# Altium project My Seeeduino Nano.PrjPcb
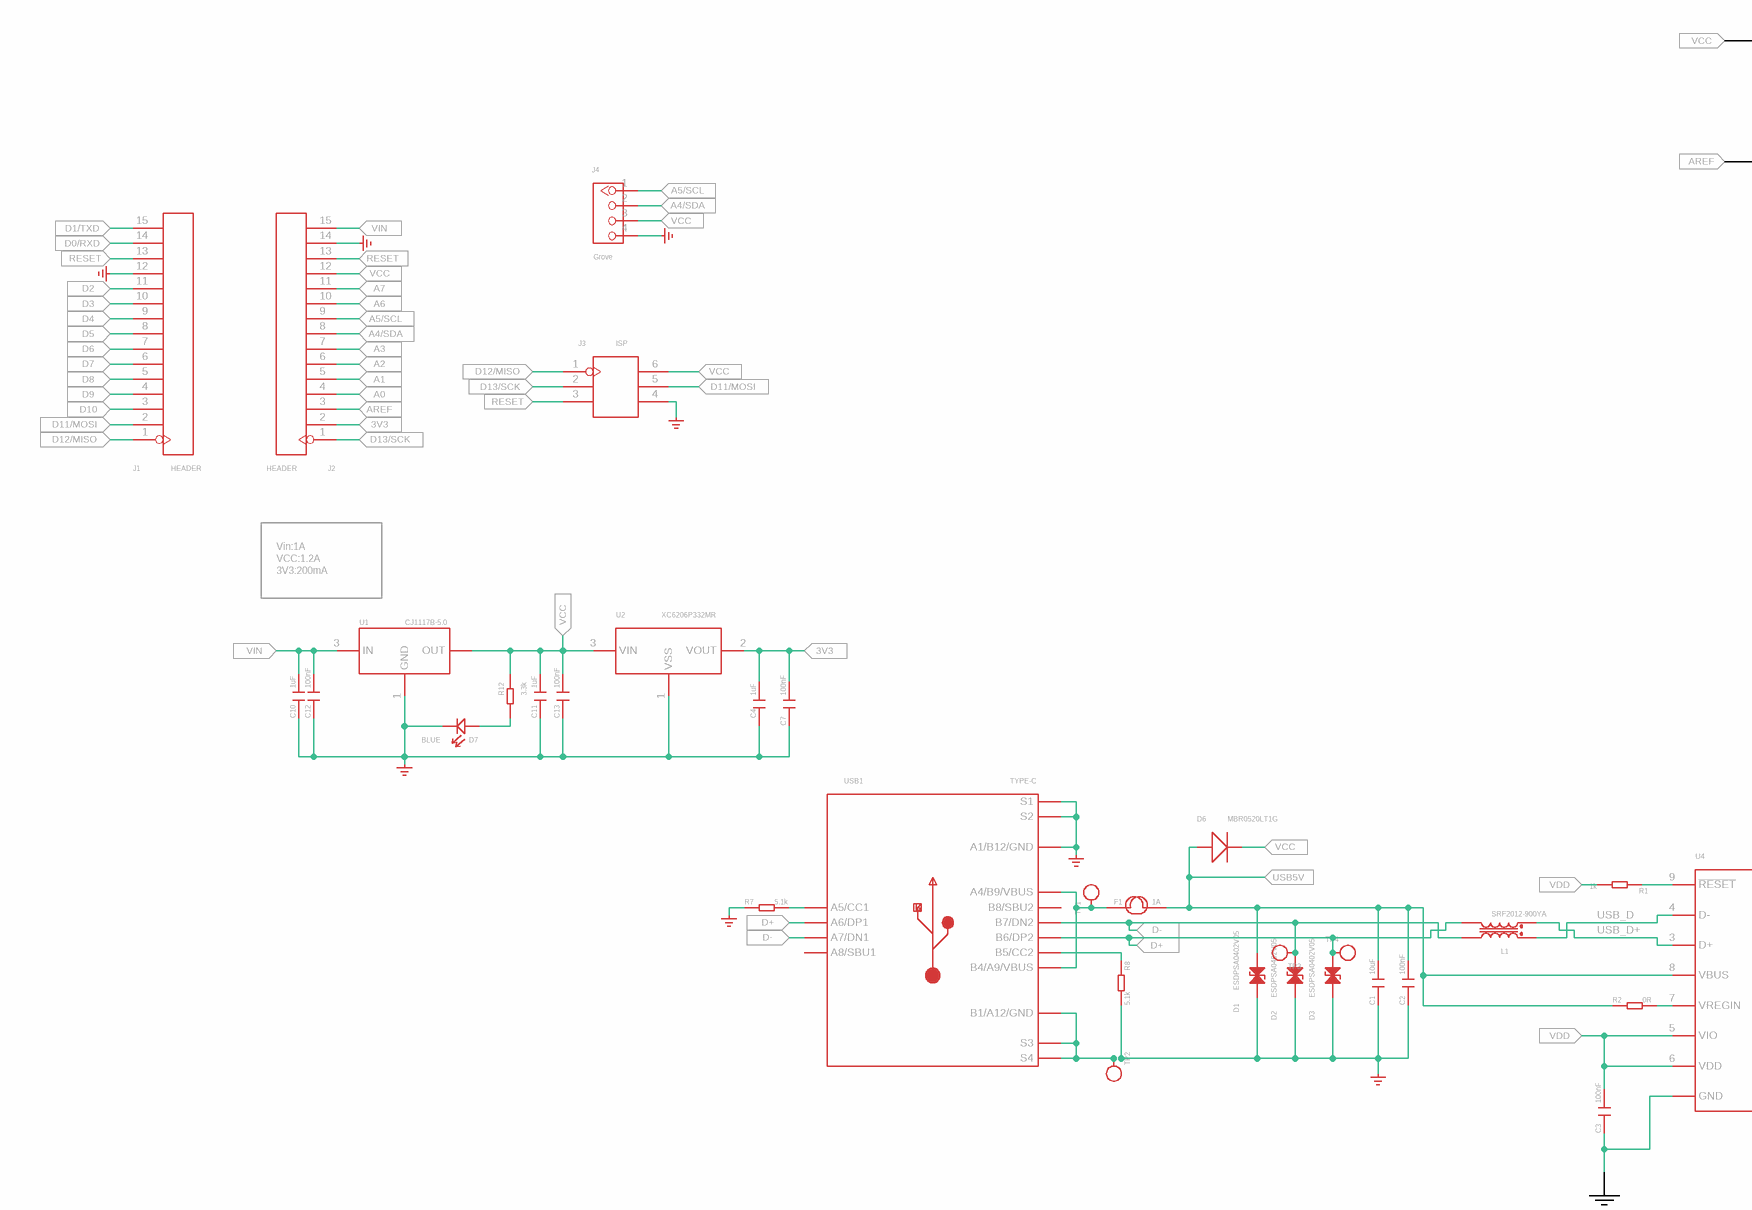
[diagram p0: Лист1.SchDoc, top left]
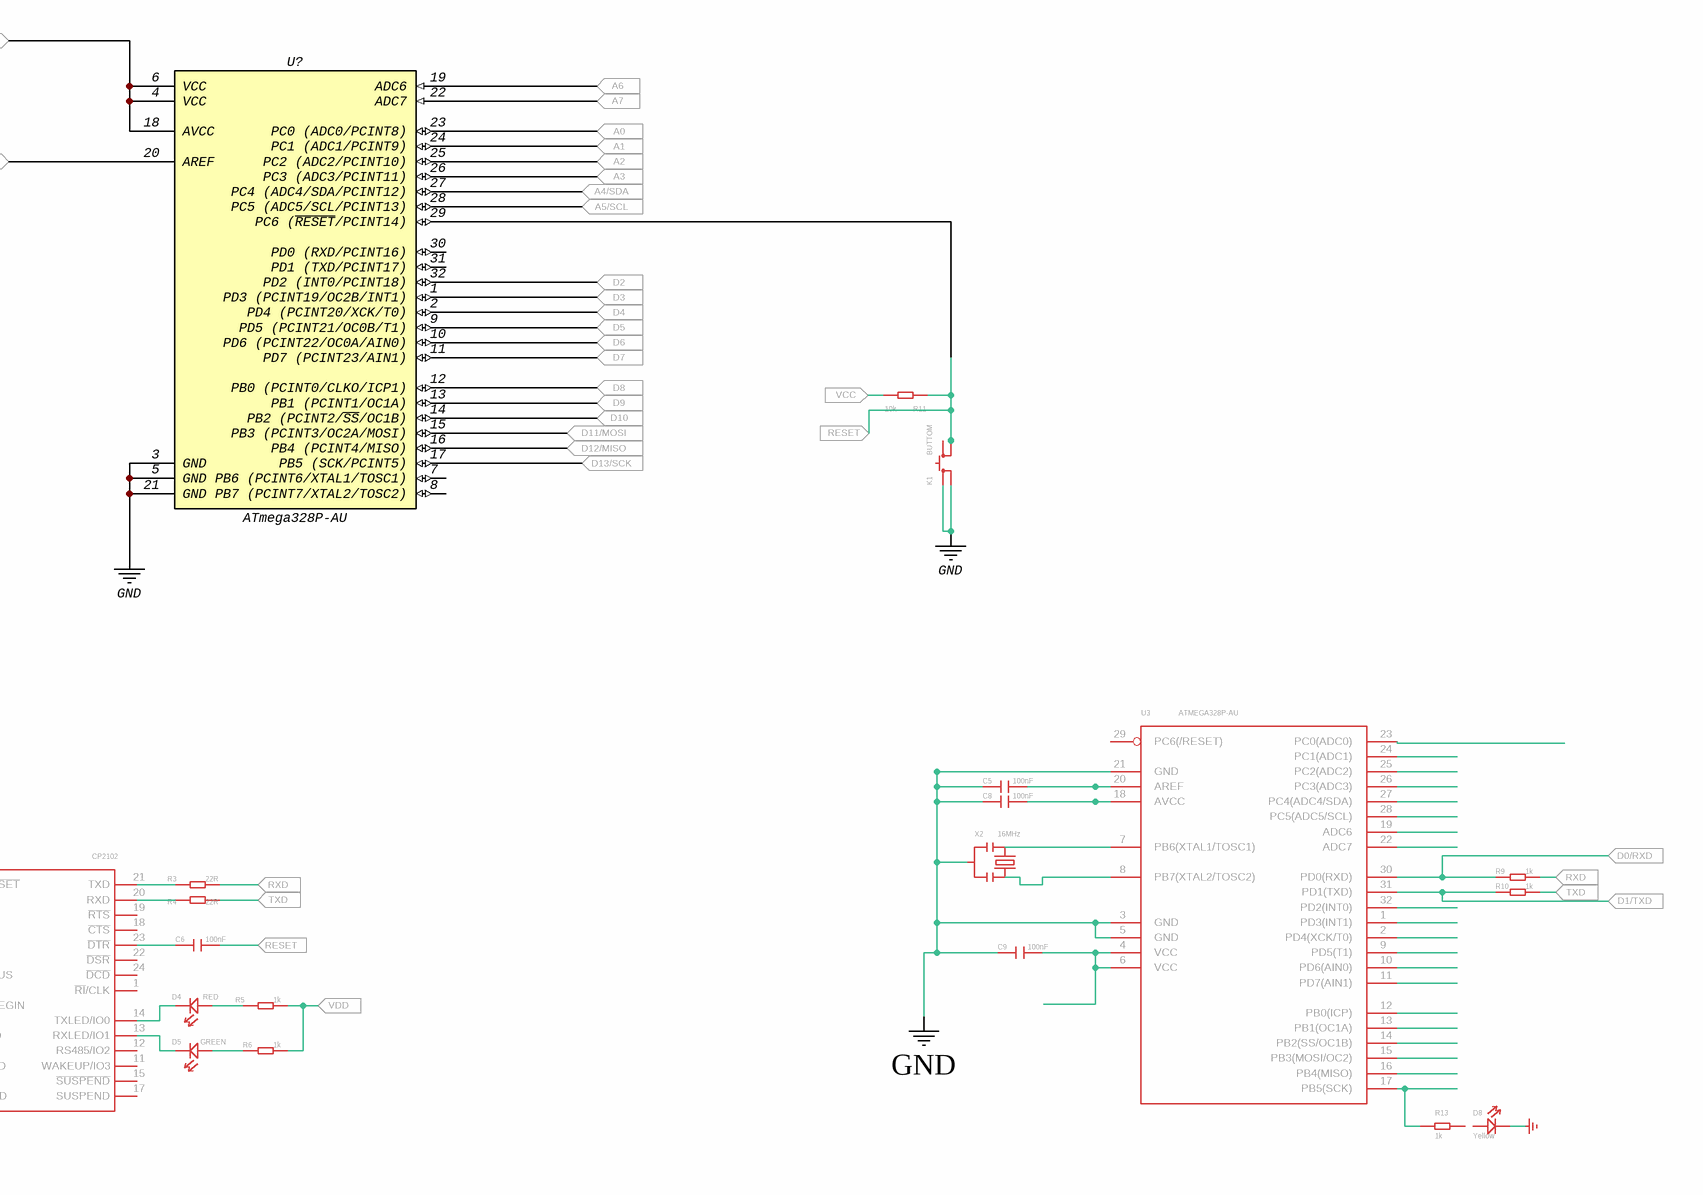
[diagram p1: Лист1.SchDoc, top right]
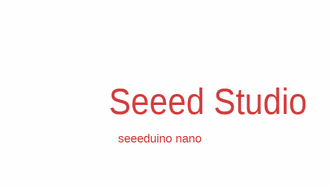
[diagram p2: Лист1.SchDoc, bottom right]
1 sheet, 61 parts. Net scope: flat (ports and power ports of the same name join across sheets).
Board file: Узел.PcbDoc

## Sheet Лист1.SchDoc
size 839 x 594 mm; Origin: Eagle; GateName_1: G$1; SymbolName_1: SEEEDSTUDIO-SCH-FRAME-BIG; LibraryName: moudle-new; DeviceSetName: SEEEDSTUDIO-SCH-FRAME-BIG; Sheet: Sheet:; SeeedStudio: Seeed Studio; Design: Design:; Check: Check:; Vision: Vision:; CC-BY-SA: CC-BY-SA; SheetNumber: 1; SheetTotal: 2; PageSetup: Record=PageOptions|CenterHorizontal=True|CenterVertical=True|PrintScale=0.94|XCorrection=1.00|YCorrection=1.00|PrintKind=1|BorderSize=5000000|LeftOffset=0|BottomOffset=0|Orientation=1|PaperLength=1000|PaperWidth=1000|Scale=100|PaperSource=7|PrintQuality=-4|MediaType=1|DitherType=10|PaperKind=A4|PrintScaleMode=1; ГОСТ 1: ГОСТ 2.104-2006 Глава 6, Форма 1; ГОСТ 2: ГОСТ 2.701-2008 Таблица 1, Таблица 2; ГОСТ 3: ГОСТ 2.301-68; ГОСТ 4: ГОСТ 2.302-68; DocumentName: Sheet1.SCHDOC

### Parts
C1  10uF  [C0603]
C2  100nF  [C0603]
C3  100nF  [C0603]
C4  1uF  [C0603]
C5  100nF  [C0603]
C6  100nF  [C0603]
C7  100nF  [C0603]
C8  100nF  [C0603]
C9  100nF  [C0603]
C10  1uF  [C0603]
C11  1uF  [C0603]
C12  100nF  [C0603]
C13  100nF  [C0603]
D1  ESDPSA0402V05  [ESD-0402]
D2  ESDPSA0402V05  [ESD-0402]
D3  ESDPSA0402V05  [ESD-0402]
D4  RED  [LED-0402]
D5  GREEN  [LED-0402]
D6  MBR0520LT1G  [SOD123-2.7X1.6]
D7  BLUE  [LED-0402]
D8  Yellow  [LED-0402]
F1  1A  [F1206]
G1  GND_POWER  (value not drawn)
G2  GND_POWER  (value not drawn)
G5  GND_POWER  (value not drawn)
G7  GND_POWER  (value not drawn)
G8  GND_POWER  (value not drawn)
G9  GND_POWER  (value not drawn)
G10  GND_POWER  (value not drawn)
G12  GND_POWER  (value not drawn)
G13  GND_POWER  (value not drawn)
J1  HEADER  [H15-2.54]
J2  HEADER  [H15-2.54]
J3  ISP  [H2X3-2.54]
J4  Grove  [HW4-2.0]
K1  BUTTOM  [SW4P-SMD-4.5X3.2X2.5MM]
L1  SRF2012-900YA  [INT4-0.85-2X1.25X1.2MM]
R1  1k  [R0603]
R2  0R  [R0603]
R3  22R  [R0603]
R4  22R  [R0603]
R5  1k  [R0603]
R6  1k  [R0603]
R7  5.1k  [R0603]
R8  5.1k  [R0603]
R9  1k  [R0603]
R10  1k  [R0603]
R11  10k  [R0603]
R12  3.3k  [R0603]
R13  1k  [R0603]
TP1  TEST  [TP-D45MIL]  (value not drawn)
TP2  TEST  [TP-D45MIL]  (value not drawn)
TP3  TEST  [TP-D45MIL]  (value not drawn)
TP4  TEST  [TP-D45MIL]  (value not drawn)
U1  CJ1117B-5.0  [SOT-223]
U2  XC6206P332MR  [SOT-23]
U3  ATMEGA328P-AU  [TQFP32-0.8-7X7MM]
U4  CP2102  [QFN24G-0.5-4X4MM]
U?  ATmega328P-AU  [32A_M]
USB1  TYPE-C  [USB2.0-TYPE-C]
X2  16MHz  [RESONATOR3-SMD-3.6X1.3X0.8MM]

### Ports
3V3 (in), A0 (in), A1 (in), A2 (in), A3 (in), A4/SDA (in), A5/SCL (in), A6 (in), A7 (in), AREF (in), D0/RXD (in), D1/TXD (in), D2 (in), D3 (in), D4 (in), D5 (in), D6 (in), D7 (in), D8 (in), D9 (in), D10 (in), D11/MOSI (in), D12/MISO (in), D13/SCK (in), D+ (in), D- (in), RESET (in), RXD (in), TXD (in), USB5V (in), VCC (in), VDD (in), VIN (in)

### Nets
GND: C3.2 C5.2 C8.2 C9.2 K1.1(A0) K1.2(A1) U3.3(GND) U3.5(GND) U3.21(GND) U4.2_PAD(GND) U?.3(GND) U?.5(GND) U?.21(GND) X2.2
USB_D: L1.1 U4.4(D-)
USB_D+: L1.4 U4.3(D+)
NetC1_1: C1.1 C2.1 D1.2 D6.1(+) F1.2 R2.1 U4.8(VBUS) ; port USB5V
NetC1_2: C1.2 C2.2 D1.1 D2.1 D3.1 G2.?1(GND) R8.2
NetC3_1: C3.1 R1.1 R5.2 R6.2 U4.5(VIO) U4.6(VDD) ; port VDD
NetC4_1: C4.1 C7.1 J2.2 U2.2(VOUT) ; port 3V3
NetC4_2: C4.2 C7.2 C10.2 C11.2 C12.2 C13.2 D7.- G7.?1(GND) U1.1(GND) U2.1(VSS)
NetC5_1: C5.1 U3.20(AREF)
NetC6_1: C6.1 J1.13 J2.13 J3.3 K1.4(B1) R11.1 U?.29(PC6_(~{RESET}/PCINT14)) ; port RESET
NetC6_2: C6.2 U4.23(~{DTR})
NetC8_1: C8.1 U3.18(AVCC)
NetC9_1: C9.1 U3.4(VCC) U3.6(VCC)
NetC10_1: C10.1 C12.1 J2.15 U1.3(IN) ; port VIN
NetC11_1: C11.1 C13.1 D6.2(-) J2.12 J3.6 J4.3 R11.2 R12.1 U1.2_TER(OUT) U2.3(VIN) U?.4(VCC) U?.6(VCC) U?.18(AVCC) ; port VCC
NetD2_2: D2.2 L1.2 TP3.T USB1.A7(A7/DN1) USB1.B7(B7/DN2) ; port D-
NetD3_2: D3.2 L1.3 TP4.T USB1.A6(A6/DP1) USB1.B6(B6/DP2) ; port D+
NetD4_+: D4.+ R5.1
NetD4_-: D4.- U4.14(TXLED/IO0)
NetD5_+: D5.+ R6.1
NetD5_-: D5.- U4.13(RXLED/IO1)
NetD7_+: D7.+ R12.2
NetD8_-: D8.- G8.?1(GND)
NetF1_1: F1.1 TP1.T USB1.A4_B9(A4/B9/VBUS) USB1.B4_A9(B4/A9/VBUS)
NetG1_?1: G1.?1(GND) USB1.A1_B12(A1/B12/GND) USB1.S1_S5(S1) USB1.S2_S6(S2)
NetG5_?1: G5.?1(GND) R7.1
NetG9_?1: G9.?1(GND) J2.14
NetG10_?1: G10.?1(GND) J1.12
NetG12_?1: G12.?1(GND) J3.4
NetG13_?1: G13.?1(GND) J4.4
NetJ1_1: J1.1 J3.1 U?.16(PB4_(PCINT4/MISO)) ; port D12/MISO
NetJ1_2: J1.2 J3.5 U?.15(PB3_(PCINT3/OC2A/MOSI)) ; port D11/MOSI
NetJ1_3: J1.3 U?.14(PB2_(PCINT2/~{SS}/OC1B)) ; port D10
NetJ1_4: J1.4 U?.13(PB1_(PCINT1/OC1A)) ; port D9
NetJ1_5: J1.5 U?.12(PB0_(PCINT0/CLKO/ICP1)) ; port D8
NetJ1_6: J1.6 U?.11(PD7_(PCINT23/AIN1)) ; port D7
NetJ1_7: J1.7 U?.10(PD6_(PCINT22/OC0A/AIN0)) ; port D6
NetJ1_8: J1.8 U?.9(PD5_(PCINT21/OC0B/T1)) ; port D5
NetJ1_9: J1.9 U?.2(PD4_(PCINT20/XCK/T0)) ; port D4
NetJ1_10: J1.10 U?.1(PD3_(PCINT19/OC2B/INT1)) ; port D3
NetJ1_11: J1.11 U?.32(PD2_(INT0/PCINT18)) ; port D2
NetJ1_14: J1.14 R9.1 U3.30(PD0(RXD)) ; port D0/RXD
NetJ1_15: J1.15 R10.1 U3.31(PD1(TXD)) ; port D1/TXD
NetJ2_1: J2.1 J3.2 U?.17(PB5_(SCK/PCINT5)) ; port D13/SCK
NetJ2_3: J2.3 U?.20(AREF) ; port AREF
NetJ2_4: J2.4 U?.23(PC0_(ADC0/PCINT8)) ; port A0
NetJ2_5: J2.5 U?.24(PC1_(ADC1/PCINT9)) ; port A1
NetJ2_6: J2.6 U?.25(PC2_(ADC2/PCINT10)) ; port A2
NetJ2_7: J2.7 U?.26(PC3_(ADC3/PCINT11)) ; port A3
NetJ2_8: J2.8 J4.2 U?.27(PC4_(ADC4/SDA/PCINT12)) ; port A4/SDA
NetJ2_9: J2.9 J4.1 U?.28(PC5_(ADC5/SCL/PCINT13)) ; port A5/SCL
NetJ2_10: J2.10 U?.19(ADC6) ; port A6
NetJ2_11: J2.11 U?.22(ADC7) ; port A7
NetR1_2: R1.2 U4.9(~{RESET})
NetR2_2: R2.2 U4.7(VREGIN)
NetR3_1: R3.1 U4.21(TXD)
NetR3_2: R3.2 R9.2 ; port RXD
NetR4_1: R4.1 U4.20(RXD)
NetR4_2: R4.2 R10.2 ; port TXD
NetR7_2: R7.2 USB1.A5(A5/CC1)
NetR8_1: R8.1 USB1.B5(B5/CC2)
NetR13_1: R13.1 U3.17(PB5(SCK))
NetTP2_T: TP2.T USB1.B1_A12(B1/A12/GND) USB1.S3 USB1.S4
NetU3_7: U3.7(PB6(XTAL1/TOSC1)) X2.1
NetU3_8: U3.8(PB7(XTAL2/TOSC2)) X2.3

Not connected (* = marked no-connect by the designer): D8 +; K1 3(B0); R13 2; U3 1(PD3(INT1)) 2(PD4(XCK/T0)) 9(PD5(T1)) 10(PD6(AIN0)) 11(PD7(AIN1)) 12(PB0(ICP)) 13(PB1(OC1A)) 14(PB2(SS/OC1B)) 15(PB3(MOSI/OC2)) 16(PB4(MISO)) 19(ADC6) 22(ADC7) 23(PC0(ADC0)) 24(PC1(ADC1)) 25(PC2(ADC2)) 26(PC3(ADC3)) 27(PC4(ADC4/SDA)) 28(PC5(ADC5/SCL)) 29(PC6(/RESET)) 32(PD2(INT0)); U4 1(~{RI}/CLK) 11(WAKEUP/IO3) 12(RS485/IO2) 15(~{SUSPEND}) 17(SUSPEND) 18(~{CTS}) 19(~{RTS}) 22(~{DSR}) 24(~{DCD}); U? 7(PB6_(PCINT6/XTAL1/TOSC1)) 8(PB7_(PCINT7/XTAL2/TOSC2)) 30(PD0_(RXD/PCINT16)) 31(PD1_(TXD/PCINT17)); USB1 A8(A8/SBU1) B8(B8/SBU2)

### Notes on the sheet
- Vin:1A
  VCC:1.2A
  3V3:200mA
- Seeed Studio
- seeeduino nano
- Перв.примен.
- Справ.№
- Подп. и дата
- Инв.№ дубл.
- Взам.инв.№
- Подп.и дата
- Изм.
- Лист
- № докум.
- Подп.
- Дата
- Лит.
- Масштаб
- Масса
- Разраб.
- Пров.
- Т.контр.
- Схема электрическая структурная
- Листов
- Инв.№ подл.
- Н.контр.
- Утв.
- Копировал
- Формат  A1

### Library data of the parts
C1 C2 = CAP-0603: Ceramic Capacitors; GateName_1: C; DeviceName: -0603; DeviceSetName: CAP; SymbolName_1: C; LibraryName: Discrete-new
C3-C13 = C*-0603: Ceramic Capacitors; GateName_1: C; DeviceName: -0603; DeviceSetName: C*; SymbolName_1: C; LibraryName: Discrete-small
D1-D3 = D-ESD-2P-DOUBLE-0402: GateName_1: G$1; DeviceName: -0402; SymbolName_1: D-ESD-2P-DOUBLE; LibraryName: Discrete-new; DeviceSetName: D-ESD-2P-DOUBLE
D4 D5 D7 D8 = LED-0402: GateName_1: LED; DeviceName: -0402; SymbolName_1: LED; LibraryName: Discrete-new; DeviceSetName: LED
D6 = D*'MBR0520LT1': GateName_1: D; SymbolName_1: DIODE; DeviceSetName: D*; DeviceName: 'MBR0520LT1'; LibraryName: Discrete-smallsmall
F1 = FUSE'1206': GateName_1: F; SymbolName_1: FUSE; DeviceName: '1206'; LibraryName: Discrete-new; DeviceSetName: FUSE
G1 G2 G5 G7-G10 G12 G13 = GND_POWER: GateName_1: G$1; SymbolName_1: GND_POWER; LibraryName: Power or GND; DeviceSetName: GND_POWER
J1 J2 = HEADER-15P'2.54': Header 15Standard 15-pin 0.1" header. Use with straight break away headers (SKU : PRT-00116), right angle break away headers (PRT-00553), swiss pins (PRT-00743), machine pins (PRT-00117), and female headers (PRT-00115).; GateName_1: G$1; DeviceName: '2.54'; SymbolName_1: HEADER-15P; LibraryName: Connector-new; DeviceSetName: HEADER-15P
J3 = HEADER-2X3P-2.54: GateName_1: J; DeviceName: -2.54; SymbolName_1: HEADER-2X3P; LibraryName: Connector-new; DeviceSetName: HEADER-2X3P
J4 = GROVE-CONNECTOR-DIP-2.0: 4P-2.0:320110033;4P-2.0-90D:320110034; GateName_1: G$1; DeviceName: -2.0; SymbolName_1: GROVE-CONNECTOR-DIP; LibraryName: Connector-new; DeviceSetName: GROVE-CONNECTOR-DIP
K1 = BUTTON-4P-4.5X3.2: GateName_1: G$1; SymbolName_1: BOTTON-4P; DeviceName: -4.5X3.2; LibraryName: Switch; DeviceSetName: BUTTON-4P
L1 = INDUCTOR-COMMON-MODE-SRF2012-900YA: GateName_1: G$1; SymbolName_1: INDUCTOR-COMMON-MODE; DeviceName: -SRF2012-900YA; LibraryName: Discrete-new; DeviceSetName: INDUCTOR-COMMON-MODE
R1-R13 = R*-0603: GateName_1: R; DeviceName: -0603; DeviceSetName: R*; SymbolName_1: R; LibraryName: Discrete-small
TP1-TP4 = TEST-POINT'4545': PARTNO: DNP; GateName_1: TP; DeviceName: '4545'; SymbolName_1: TEST-POINT; LibraryName: Discrete-new; DeviceSetName: TEST-POINT
U1 = PMIC-CJ*1117S: Low Drop Fixed And Adjustable Positive Voltage Regulators http://www.datasheetcatalog.org/datasheet/SGSThomsonMicroelectronics/mXuqtqv.pdf; GateName_1: G$1; DeviceName: S; SymbolName_1: PMIC-CJ*1117; LibraryName: IC-new; DeviceSetName: PMIC-CJ*1117
U2 = PMIC-XC6206PMR: LOW ESR Cap.Compatible Positive Voltage Regulators; GateName_1: G$1; DeviceName: MR; SymbolName_1: PMIC-XC6206P; LibraryName: IC-new; DeviceSetName: PMIC-XC6206P
U3 = MCU-ATMEGA8/168/328'AU': GateName_1: G$1; DeviceName: 'AU'; SymbolName_1: MCU-ATMEGA8/168/328; LibraryName: IC-new; DeviceSetName: MCU-ATMEGA8/168/328
U4 = CONVERTER-CP2102N(QFN24): GateName_1: G$1; SymbolName_1: CONVERTER-CP2102N(QFN24); LibraryName: IC-new; DeviceSetName: CONVERTER-CP2102N(QFN24)
U? = CMP-0095-00269-2: 8-bit AVR Microcontroller, 32KB Flash, 1KB EEPROM, 2KB SRAM, 32-pin TQFP, Industrial Grade (-40°C to 85°C); PackageDescription: 32-Lead, 7x7x1.0 mm Body, 0.8mm Lead Pitch, Thin Profile Plastic Quad Flat Package (TQFP); DatasheetVersion: revD, May-2011; RevisionNote: DatasheetVersion & PackageVersion updated. URLs added.; ComponentLink1URL: http://www.atmel.com/; ComponentLink2Description: ATmega48A/48PA/88A/88PA/168A/168PA/328/328P Datasheet; Code_JEDEC: MS-026-ABA; ComponentLink1Description: Manufacturer URL; PackageReference: 32A; ComponentLink3Description: ATmega48A/48PA/88A/88PA/168A/168PA/328/328P Summary; ComponentLink2URL: http://www.atmel.com/dyn/resources/prod_documents/doc8271.pdf; PackageVersion: revC, Oct-2010; ComponentLink3URL: http://www.atmel.com/dyn/resources/prod_documents/8271S.pdf
USB1 = USB2.0-TYPE-C: GateName_1: USB; SymbolName_1: USB2.0-TYPE-C; LibraryName: Connector-new; DeviceSetName: USB2.0-TYPE-C
X2 = CRYSTAL-RESONATOR: ResonatorSmall SMD resonator. This is the itty bitty 10/20MHz resonators with built in caps. CSTCE10M0G55 and CSTCE20M0V53. Footprint has been reviewed closely but hasn't been tested yet.; GateName_1: G$1; SymbolName_1: CRYSTAL-RESONATOR; LibraryName: Discrete-new; DeviceSetName: CRYSTAL-RESONATOR